# EAGLE design Atrix_breakout (EAGLE 7.2.0)
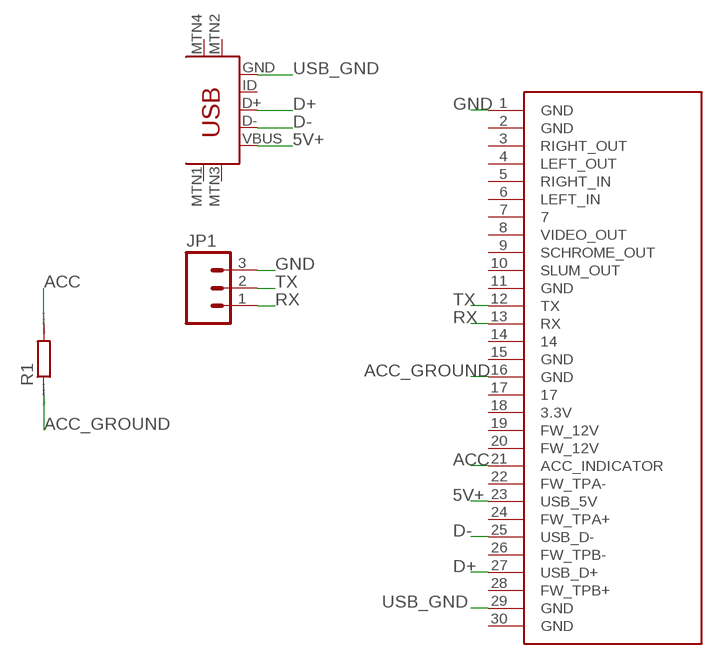
[diagram p0: schematic, sheet 1]

## Parts
JP1  M03  [03P]
R1  R0207/10  [0207/10]
U$1  IPOD_CONNECTOR_MALE  [IPOD_MALE_CONNECTOR]
U$3  USB-MINIB-5PIN  [USB-MINIB]

## Nets
5V+: U$1.23(USB_5V) U$3.VBUS
ACC: R1.2 U$1.21(ACC_INDICATOR)
ACC_GROUND: R1.1 U$1.16(GND)
D+: U$1.27(USB_D+) U$3.D+
D-: U$1.25(USB_D-) U$3.D-
GND: JP1.3 U$1.1(GND)
RX: JP1.1 U$1.13(RX)
TX: JP1.2 U$1.12(TX)
USB_GND: U$1.29(GND) U$3.GND
Unconnected: U$1.2(GND) U$1.3(RIGHT_OUT) U$1.4(LEFT_OUT) U$1.5(RIGHT_IN) U$1.6(LEFT_IN) U$1.7 U$1.8(VIDEO_OUT) U$1.9(SCHROME_OUT) U$1.10(SLUM_OUT) U$1.11(GND) U$1.14 U$1.15(GND) U$1.17 U$1.18(3.3V) U$1.19(FW_12V) U$1.20(FW_12V) U$1.22(FW_TPA-) U$1.24(FW_TPA+) U$1.26(FW_TPB-) U$1.28(FW_TPB+) U$1.30(GND) U$3.ID U$3.MTN1(MTN2) U$3.MTN2(MTN3) U$3.MTN3(MTN1) U$3.MTN4

## Library data of the parts
JP1 = con-amp-quick:M03: AMP QUICK CONNECTOR; OC_FARNELL: unknown; OC_NEWARK: unknown
R1 = eagle-ltspice:R: RESISTOR, European symbol; SPICEMODEL: NONE; SPICEPREFIX: R
U$1 = SparkFun-Connectors:IPOD_CONNECTOR_MALE: iPod Male Connector This is the connector that will insert into an iPods. Use this connector to gain access to the various iPod pins. Schematic and footprint are not yet production proven. The PCB thickness must be more thin than the standard 0.062" FR4. Spark Fun Electronics SKU : DEV-00633
U$3 = SparkFun-Connectors:USB-MINIB: Mini-USB "B" connector with 5th pin broken out. Created new symbol breaking out 5th "ID" pin in mini/micro USB connector spec. See: http://en.wikipedia.org/wiki/Mini_usb#Cables. Uses same footprint as 4-pin symbol. Also added pins to connect to mounting / shield pads if required (probably not generally needed as signals aren't shielded once they leave the connector).; PROD_ID: CONN-08193

## Board
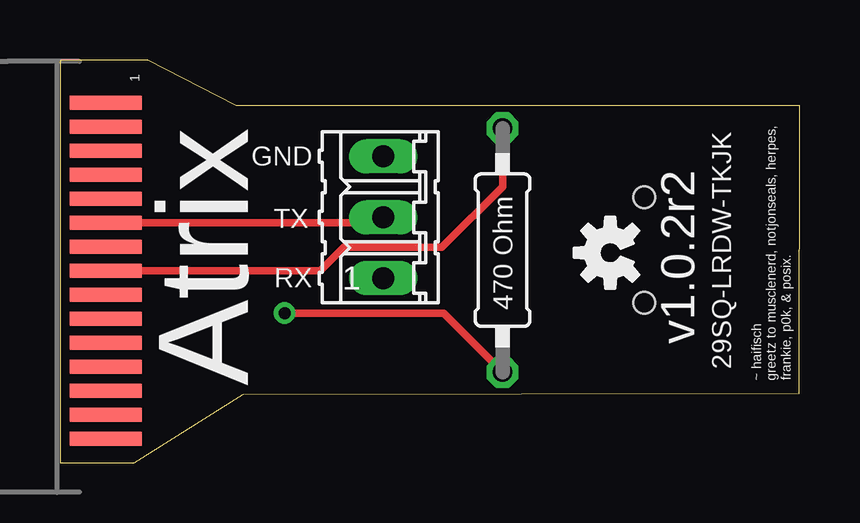
[diagram p1: board, top side]
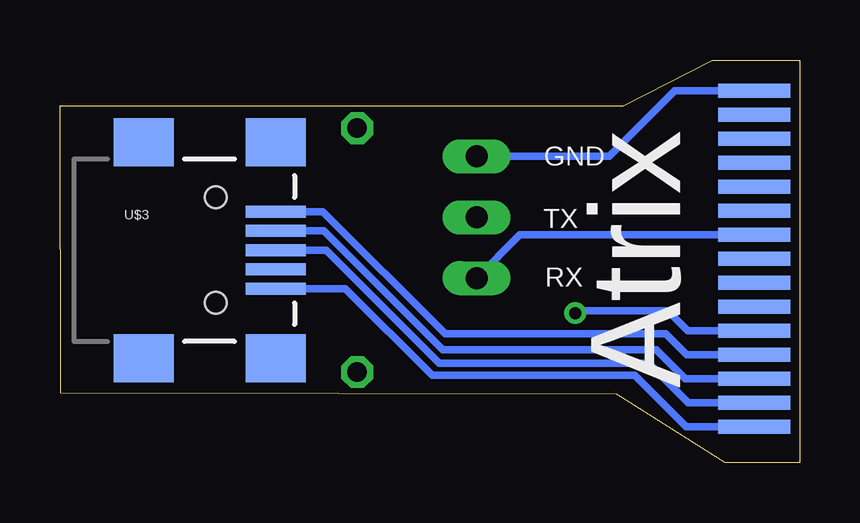
[diagram p2: board, bottom side, seen from below]

Size 30.82 x 16.79 mm. Coordinates in mm from the lower left corner, seen from the top.
Outline: 0,0 3.1,0 7.63,2.87 30.8,2.91 30.82,14.88 7.35,14.88 3.66,16.79 0,16.78 0,0
Copper layers (1*16): Top 0.035mm / dielectric 1.5mm / Bottom 0.035mm
Design rules "default": minimum track width 10mil, minimum drill 24mil, track to track 8mil, track to pad 8mil, pad to pad 8mil, via to via 8mil, smd to smd 8mil, copper to edge 40mil, drill to drill 8mil, minimum pad ring 10mil, minimum via ring 8mil, stop-mask expansion 4mil, vias tented up to drill 0mil, thermal gap 10mil

### Footprints (pad centres in the part's own frame; a part is rotated, then mirrored left to right if it is on the bottom)
03P = drill 0.914 long: 1 -2.54,0; 2 0,0; 3 2.54,0
0207/10 = drill 0.813 octagon: 1 -5.08,0; 2 5.08,0
IPOD_MALE_CONNECTOR = smd 0.6 x 3 bottom: 1 7.5,0; 3 6.5,0; 5 5.5,0; 7 4.5,0; 9 3.5,0; 11 2.5,0; 13 1.5,0; 15 0.5,0; 17 -0.5,0; 19 -1.5,0; 21 -2.5,0; 23 -3.5,0; 25 -4.5,0; 27 -5.5,0; 29 -6.5,0 | smd 0.6 x 3: 2 7,0; 4 6,0; 6 5,0; 8 4,0; 10 3,0; 12 2,0; 14 1,0; 16 0,0; 18 -1,0; 20 -2,0; 22 -3,0; 24 -4,0; 26 -5,0; 28 -6,0; 30 -7,0
USB-MINIB = smd 2.5 x 0.5: D+ 2.5,0; D- 2.5,0.8; GND 2.5,-1.6; ID 2.5,-0.8; VBUS 2.5,1.6 | smd 2.5 x 2: MTN1 -3,4.5; MTN2 2.5,4.5; MTN3 -3,-4.5; MTN4 2.5,-4.5 | hole 0.9: 0,2.2; 0,-2.2

### Placement (x,y rotation side)
JP1  13.47,10.23 90 top
R1  18.44,8.86 270 top
U$1  1.91,8 90 top
U$2  [OSHW-LOGO-S]  22.92,8.76 90 top
U$3  24.34,8.87 0 bottom

### Tracks (layer width: path | path; a pad name or v marks a point on that pad's centre or on a via)
5V+
  Bottom 0.305: U$3.VBUS 19.87,10.46 14.77,5.37 5.58,5.37 4.71,4.5 U$1.23
ACC  (via drill 0.5)
  Top 0.305: v9.36,6.24 15.98,6.24 R1.2
  Bottom 0.305: U$1.21 4.67,5.5 5.51,6.34 9.26,6.34 v9.36,6.24
ACC_GROUND
  Top 0.305: U$1.16 10.85,8 11.83,8.98 15.91,8.98 18.44,11.51 R1.1
D+
  Bottom 0.305: U$3.D+ 19.74,8.86 15.02,4.15 6.29,4.15 4.65,2.51 U$1.27
D-
  Bottom 0.305: U$1.25 4.77,3.5 5.99,4.72 14.87,4.72 19.83,9.68 21.83,9.68 U$3.D-
GND
  Bottom 0.305: JP1.3 7.95,12.77 5.21,15.51 U$1.1
RX
  Bottom 0.305: U$1.13 11.66,9.5 JP1.1
TX
  Top 0.305: U$1.12 13.24,10 JP1.2
USB_GND
  Bottom 0.305: U$1.29 4.74,1.5 6.88,3.65 15.32,3.65 18.93,7.26 U$3.GND

### Text on the board
tNames: 1 | 29SQ-LRDW-TKJK | 470 Ohm | v1.0.2r2 | ~ haifisch / greetz to musclenerd, notjonseals, herpes, / frankie, p0k, & posix.
_tsilk: GND | TX | RX | Atrix
_bsilk: Atrix | GND | TX | RX